# Altium schematic sheet Sheet1.SchDoc: VIOB
size 420 x 297 mm; ApprovedBy: PBaizan; CheckedBy: PBaizan; Author: PBaizan; CompanyName: IONOSENS; DrawnBy: PBaizan; Engineer: PBaizan; Organization: IONOSENS; DocumentNumber: 20210001002SCH; Revision: 01; SheetNumber: 01; SheetTotal: 03; PartNumber: 20210001001; SubTitle: VISIR Instrument Oscilloscope Board (Control); Scale: None; ConfigElement: VIOB; Project: VISIR; ENG_APP_DATE: 18/03/2021; DSN_APP_DATE: 18/03/2021; CHK_APP_DATE: 18/03/2021; CAGE_CODE: 0002-21; DOC_NO_SCH_DWG: 210001002SCH
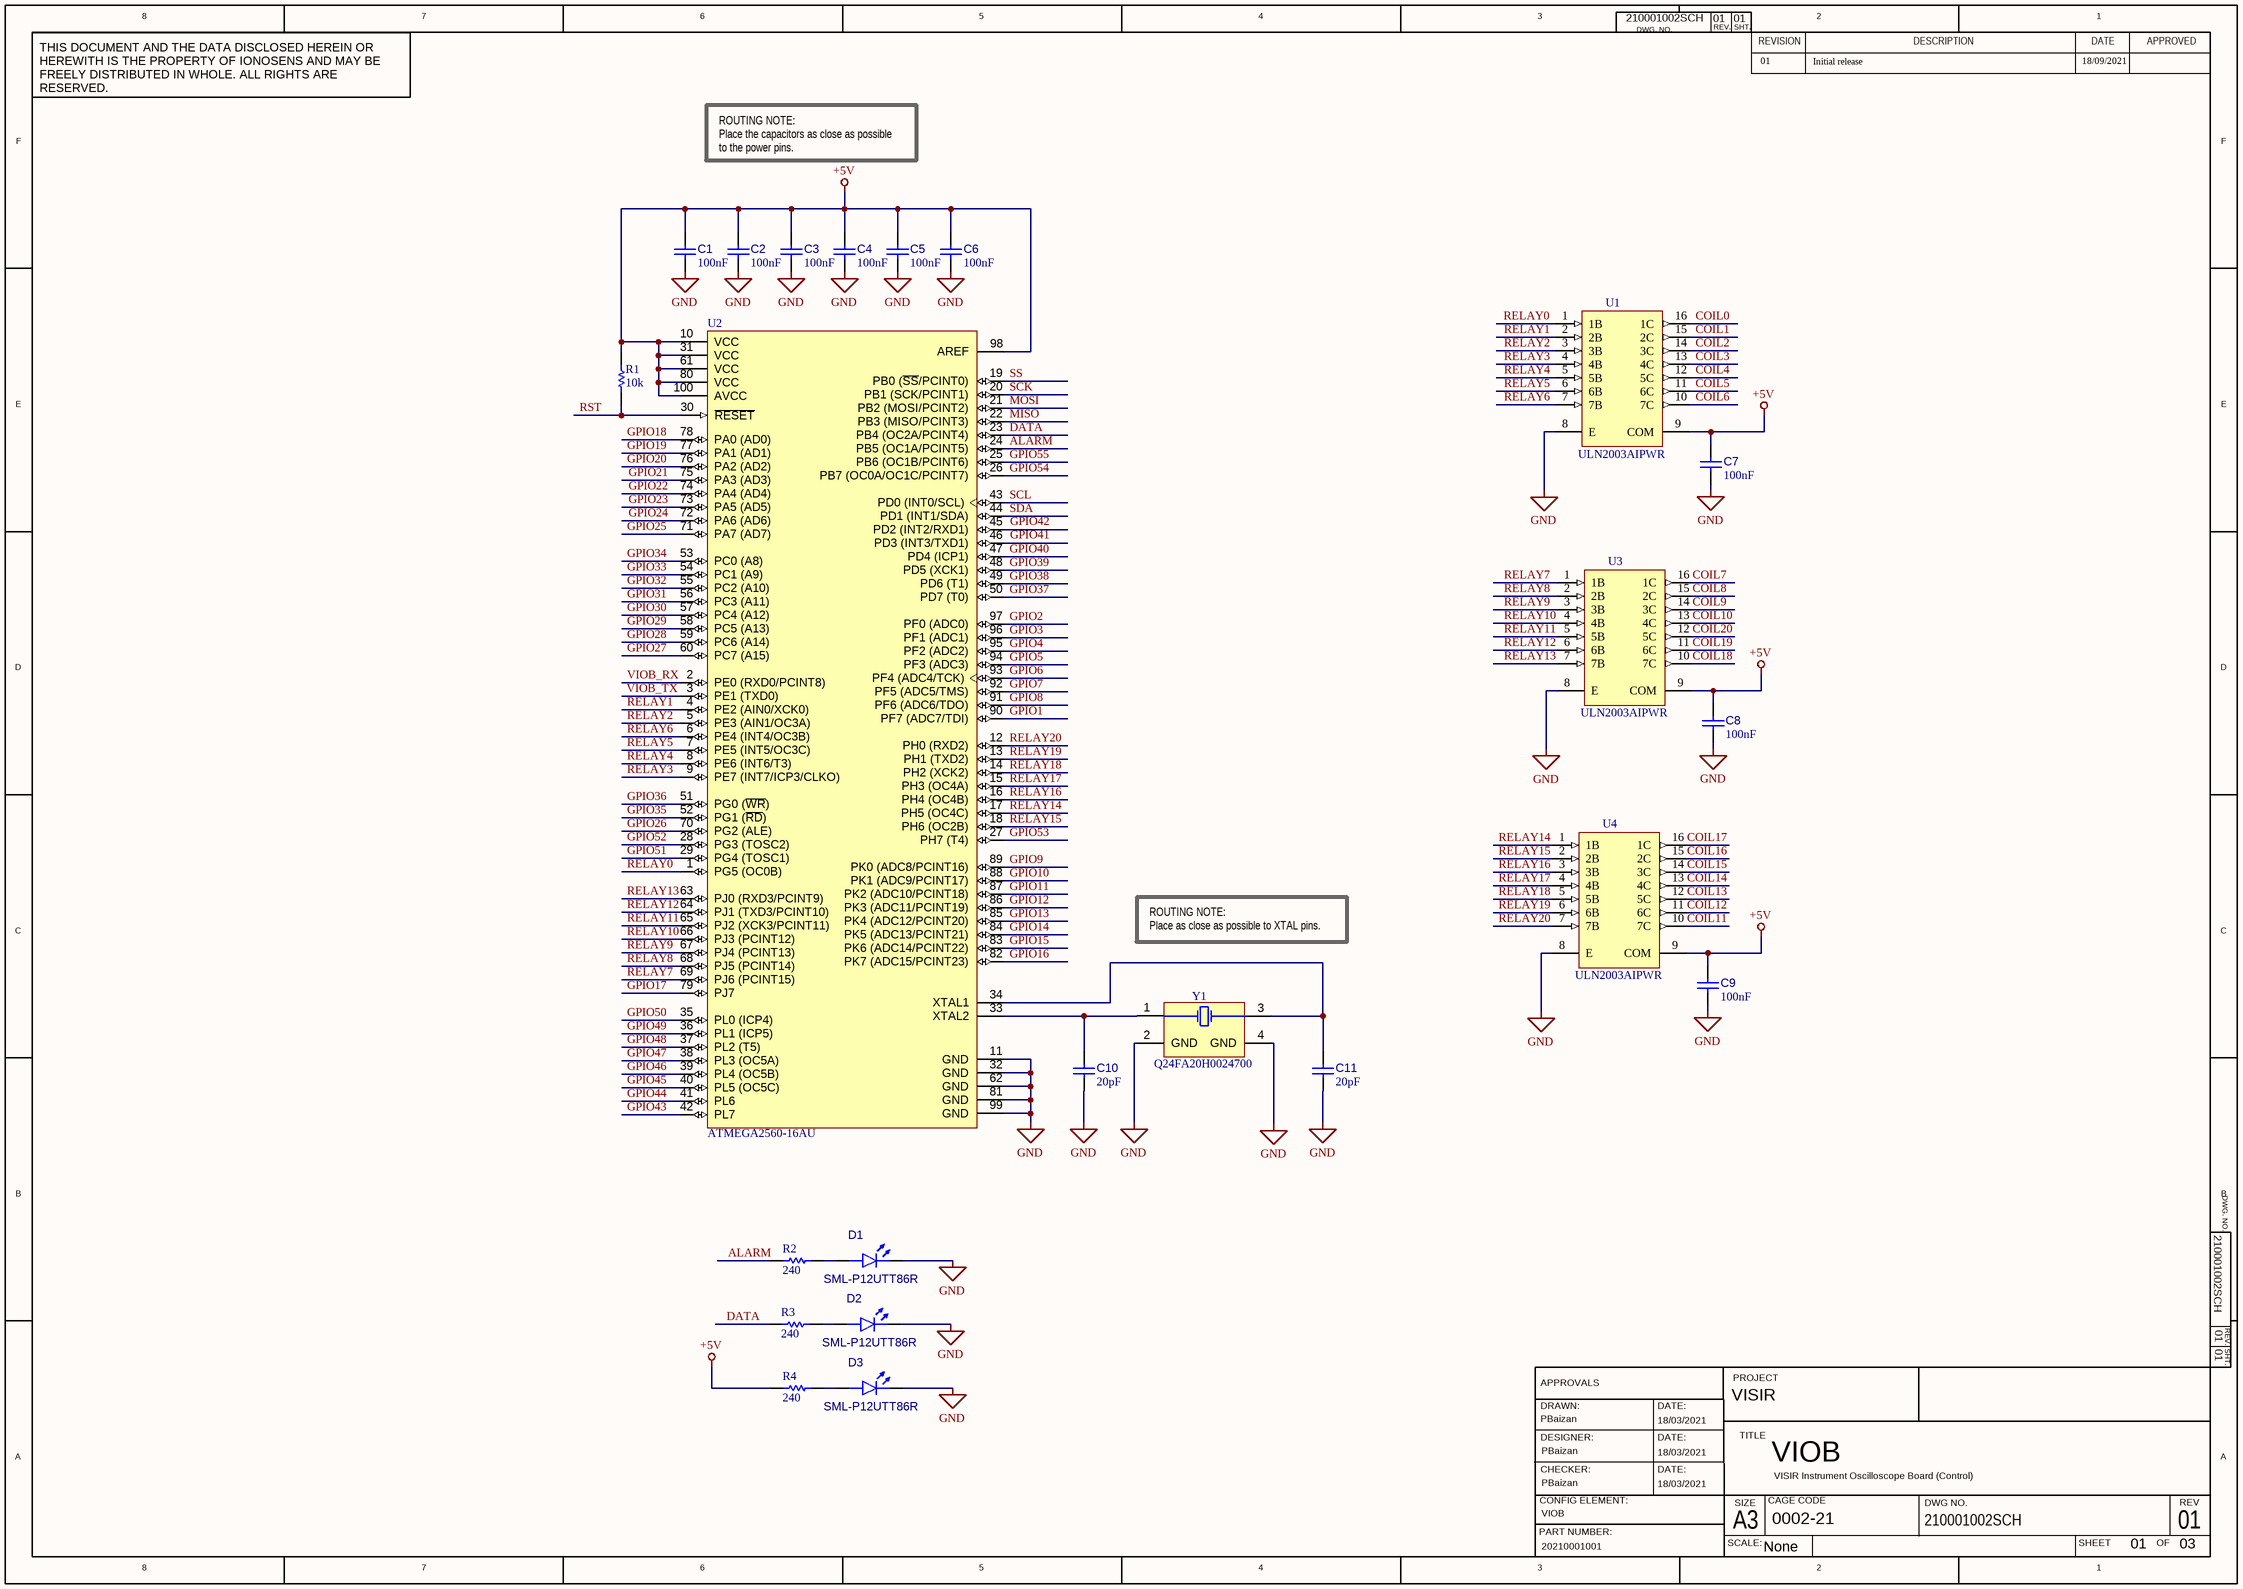
[diagram p0: Sheet1.SchDoc]

## Parts
C1  value 100nF  [CAPC1005X06M]  (hidden comment: CC0402JRX7R7BB104)
C2  value 100nF  [CAPC1005X06M]  (hidden comment: CC0402JRX7R7BB104)
C3  value 100nF  [CAPC1005X06M]  (hidden comment: CC0402JRX7R7BB104)
C4  value 100nF  [CAPC1005X06M]  (hidden comment: CC0402JRX7R7BB104)
C5  value 100nF  [CAPC1005X06M]  (hidden comment: CC0402JRX7R7BB104)
C6  value 100nF  [CAPC1005X06M]  (hidden comment: CC0402JRX7R7BB104)
C7  value 100nF  [CAPC1005X06M]  (hidden comment: CC0402JRX7R7BB104)
C8  value 100nF  [CAPC1005X06M]  (hidden comment: CC0402JRX7R7BB104)
C9  value 100nF  [CAPC1005X06M]  (hidden comment: CC0402JRX7R7BB104)
C10  value 20pF  [CAPC1005X06M]  (hidden comment: CC0402JRNPO9BN200)
C11  value 20pF  [CAPC1005X06M]  (hidden comment: CC0402JRNPO9BN200)
D1  SML-P12UTT86R  [DIOC1005X02R]
D2  SML-P12UTT86R  [DIOC1005X02R]
D3  SML-P12UTT86R  [DIOC1005X02R]
R1  value 10k  [RESC1005X04M]  (hidden comment: AC0402FR-0710KL)
R2  value 240  [RESC1005X04M]  (hidden comment: AC0402FR-07240RL)
R3  value 240  [RESC1005X04M]  (hidden comment: AC0402FR-07240RL)
R4  value 240  [RESC1005X04M]  (hidden comment: AC0402FR-07240RL)
U1  ULN2003AIPWR  [TSOP65P640X120-16M]
U2  ATMEGA2560-16AU  [ATML-100A_M]
U3  ULN2003AIPWR  [TSOP65P640X120-16M]
U4  ULN2003AIPWR  [TSOP65P640X120-16M]
Y1  Q24FA20H0024700  [FA-20H]

## Nets
+5V: C1.2 C2.2 C3.2 C4.2 C5.2 C6.2 C7.2 C8.2 C9.2 R1.2 R4.1 U1.9(COM) U2.10(VCC) U2.31(VCC) U2.61(VCC) U2.80(VCC) U2.98(AREF) U2.100(AVCC) U3.9(COM) U4.9(COM)
GND: C1.1 C2.1 C3.1 C4.1 C5.1 C6.1 C7.1 C8.1 C9.1 C10.1 C11.1 D1.1(K) D2.1(K) D3.1(K) U1.8(E) U2.11(GND) U2.32(GND) U2.62(GND) U2.81(GND) U2.99(GND) U3.8(E) U4.8(E) Y1.2(GND) Y1.4(GND)
ALARM: R2.1 U2.24(PB5_(OC1A/PCINT5))
COIL0: U1.16(1C)
COIL1: U1.15(2C)
COIL2: U1.14(3C)
COIL3: U1.13(4C)
COIL4: U1.12(5C)
COIL5: U1.11(6C)
COIL6: U1.10(7C)
COIL7: U3.16(1C)
COIL8: U3.15(2C)
COIL9: U3.14(3C)
COIL10: U3.13(4C)
COIL11: U4.10(7C)
COIL12: U4.11(6C)
COIL13: U4.12(5C)
COIL14: U4.13(4C)
COIL15: U4.14(3C)
COIL16: U4.15(2C)
COIL17: U4.16(1C)
COIL18: U3.10(7C)
COIL19: U3.11(6C)
COIL20: U3.12(5C)
DATA: R3.1 U2.23(PB4_(OC2A/PCINT4))
GPIO1: U2.90(PF7_(ADC7/TDI))
GPIO2: U2.97(PF0_(ADC0))
GPIO3: U2.96(PF1_(ADC1))
GPIO4: U2.95(PF2_(ADC2))
GPIO5: U2.94(PF3_(ADC3))
GPIO6: U2.93(PF4_(ADC4/TCK))
GPIO7: U2.92(PF5_(ADC5/TMS))
GPIO8: U2.91(PF6_(ADC6/TDO))
GPIO9: U2.89(PK0_(ADC8/PCINT16))
GPIO10: U2.88(PK1_(ADC9/PCINT17))
GPIO11: U2.87(PK2_(ADC10/PCINT18))
GPIO12: U2.86(PK3_(ADC11/PCINT19))
GPIO13: U2.85(PK4_(ADC12/PCINT20))
GPIO14: U2.84(PK5_(ADC13/PCINT21))
GPIO15: U2.83(PK6_(ADC14/PCINT22))
GPIO16: U2.82(PK7_(ADC15/PCINT23))
GPIO17: U2.79(PJ7)
GPIO18: U2.78(PA0_(AD0))
GPIO19: U2.77(PA1_(AD1))
GPIO20: U2.76(PA2_(AD2))
GPIO21: U2.75(PA3_(AD3))
GPIO22: U2.74(PA4_(AD4))
GPIO23: U2.73(PA5_(AD5))
GPIO24: U2.72(PA6_(AD6))
GPIO25: U2.71(PA7_(AD7))
GPIO26: U2.70(PG2_(ALE))
GPIO27: U2.60(PC7_(A15))
GPIO28: U2.59(PC6_(A14))
GPIO29: U2.58(PC5_(A13))
GPIO30: U2.57(PC4_(A12))
GPIO31: U2.56(PC3_(A11))
GPIO32: U2.55(PC2_(A10))
GPIO33: U2.54(PC1_(A9))
GPIO34: U2.53(PC0_(A8))
GPIO35: U2.52(PG1_(~{RD}))
GPIO36: U2.51(PG0_(~{WR}))
GPIO37: U2.50(PD7_(T0))
GPIO38: U2.49(PD6_(T1))
GPIO39: U2.48(PD5_(XCK1))
GPIO40: U2.47(PD4_(ICP1))
GPIO41: U2.46(PD3_(INT3/TXD1))
GPIO42: U2.45(PD2_(INT2/RXD1))
GPIO43: U2.42(PL7)
GPIO44: U2.41(PL6)
GPIO45: U2.40(PL5_(OC5C))
GPIO46: U2.39(PL4_(OC5B))
GPIO47: U2.38(PL3_(OC5A))
GPIO48: U2.37(PL2_(T5))
GPIO49: U2.36(PL1_(ICP5))
GPIO50: U2.35(PL0_(ICP4))
GPIO51: U2.29(PG4_(TOSC1))
GPIO52: U2.28(PG3_(TOSC2))
GPIO53: U2.27(PH7_(T4))
GPIO54: U2.26(PB7_(OC0A/OC1C/PCINT7))
GPIO55: U2.25(PB6_(OC1B/PCINT6))
MISO: U2.22(PB3_(MISO/PCINT3))
MOSI: U2.21(PB2_(MOSI/PCINT2))
RELAY0: U1.1(1B) U2.1(PG5_(OC0B))
RELAY1: U1.2(2B) U2.4(PE2_(AIN0/XCK0))
RELAY2: U1.3(3B) U2.5(PE3_(AIN1/OC3A))
RELAY3: U1.4(4B) U2.9(PE7_(INT7/ICP3/CLKO))
RELAY4: U1.5(5B) U2.8(PE6_(INT6/T3))
RELAY5: U1.6(6B) U2.7(PE5_(INT5/OC3C))
RELAY6: U1.7(7B) U2.6(PE4_(INT4/OC3B))
RELAY7: U2.69(PJ6_(PCINT15)) U3.1(1B)
RELAY8: U2.68(PJ5_(PCINT14)) U3.2(2B)
RELAY9: U2.67(PJ4_(PCINT13)) U3.3(3B)
RELAY10: U2.66(PJ3_(PCINT12)) U3.4(4B)
RELAY11: U2.65(PJ2_(XCK3/PCINT11)) U3.5(5B)
RELAY12: U2.64(PJ1_(TXD3/PCINT10)) U3.6(6B)
RELAY13: U2.63(PJ0_(RXD3/PCINT9)) U3.7(7B)
RELAY14: U2.17(PH5_(OC4C)) U4.1(1B)
RELAY15: U2.18(PH6_(OC2B)) U4.2(2B)
RELAY16: U2.16(PH4_(OC4B)) U4.3(3B)
RELAY17: U2.15(PH3_(OC4A)) U4.4(4B)
RELAY18: U2.14(PH2_(XCK2)) U4.5(5B)
RELAY19: U2.13(PH1_(TXD2)) U4.6(6B)
RELAY20: U2.12(PH0_(RXD2)) U4.7(7B)
RST: R1.1 U2.30(~{RESET})
SCK: U2.20(PB1_(SCK/PCINT1))
SCL: U2.43(PD0_(INT0/SCL))
SDA: U2.44(PD1_(INT1/SDA))
SS: U2.19(PB0_(~{SS}/PCINT0))
VIOB_RX: U2.2(PE0_(RXD0/PCINT8))
VIOB_TX: U2.3(PE1_(TXD0))
NetC10_2: C10.2 U2.33(XTAL2) Y1.1(X1)
NetC11_2: C11.2 U2.34(XTAL1) Y1.3(X2)
NetD1_2: D1.2(A) R2.2
NetD2_2: D2.2(A) R3.2
NetD3_2: D3.2(A) R4.2

## Notes on the sheet
- 01
- Initial release
- 18/09/2021
- ROUTING NOTE:
  Place the capacitors as close as possible to the power pins.
- ROUTING NOTE:
  Place as close as possible to XTAL pins.
- 8
- 7
- 6
- 5
- 4
- 3
- DWG. NO.
- REV.
- SHT.
- REVISION
- 2
- DESCRIPTION
- DATE
- 1
- APPROVED
- THIS DOCUMENT AND THE DATA DISCLOSED HEREIN OR HEREWITH IS THE PROPERTY OF IONOSENS AND MAY BE FREELY DISTRIBUTED IN WHOLE. ALL RIGHTS ARE RESERVED.
- F
- E
- D
- C
- B
- DRAWN:
- APPROVALS
- DATE:
- PROJECT
- A
- CHECKER:
- DESIGNER:
- TITLE
- PART NUMBER:
- CONFIG ELEMENT:
- SCALE:
- A3
- SIZE
- CAGE CODE
- DWG NO.
- SHEET
- OF
- REV

## Library data of the parts
C1-C9 = C01-0402-01-00001-1: Cap Ceramic 100nF 50V X7R 5% SMD 0402 125°C; Manufacturer: YAGEO; Voltage Rating: 16V; Case/Package: 0402; Capacitor Type: Ceramic; Min Operating Temperature: -55°C; Width: 508µm; Length: 1mm; Tolerance: 5%; Dielectric: X7R; RoHS Compliant: Yes; Pins: 2; Composition: Ceramic; Depth: 500µm; Voltage Rating (DC): 16V; Mount: Surface Mount; Mounting Technology: Surface Mount; Termination: SMD/SMT; Manufacturer P/N: CC0402JRX7R7BB104; Thickness: 558.8µm; Max Operating Temperature: 125°C
C10 C11 = C01-0402-01-00008-1: Cap Ceramic 20pF 50V C0G 5% SMD 0402 125°C; Manufacturer: YAGEO; Dielectric: COG; Case/Package: 0402; Tolerance: 5%; Thickness: 558.8µm; Termination: SMD/SMT; Manufacturer P/N: CC0402JRNPO9BN200; Voltage Rating: 50V; Length: 990.6µm; Depth: 500µm; Width: 508µm; Min Operating Temperature: -55°C; Mount: Surface Mount; Voltage Rating (DC): 50V; Pins: 2; Capacitor Type: Ceramic; RoHS Compliant: Yes; Composition: Ceramic; Mounting Technology: Surface Mount; Max Operating Temperature: 125°C
D1-D3 = D01-0402-01-00001-1: Led red 0402; Manufacturer: ROHM; Number of LEDs: 1; Max Power Dissipation: 52mW; Luminous Intensity: 85 mcd; Dominant Wavelength: 620 nm; Lens Style: Rectangular, Square; Forward Current: 20 mA; Forward Voltage: 2V; Mounting Technology: SMD; Case/Package: 0402; Min Operating Temperature: -40°C; Max Operating Temperature: 85°C; Manufacturer P/N: SML-P12UTT86R; Colour: red; RoHS Compliant: Yes; Pins: 2
R1 = R01-0402-01-00169-2: RES SMD 10K OHM 1% 1/16W 0402; Manufacturer: Yageo; Temperature Coefficient: 100 ppm/ºC; Power Rating: 62.5mW; Voltage Rating: 50V; Length: 990.6µm; Height: 370µm; Min Operating Temperature: -55°C; Case/Package: 0402; Features: Automotive AEC-Q200, Moisture Resistant; Packaging: Tape & Reel; Width: 508µm; Manufacturer P/N: AC0402FR-0710KL; RoHS: Yes; Max Operating Temperature: 155°C; Tolerance: 1%; Composition: Thick Film; Number of Terminations: 2
R2-R4 = R01-0402-01-00437-2: RES SMD 240 OHM 1% 1/16W 0402; Manufacturer: Yageo; Temperature Coefficient: 100 ppm/ºC; Power Rating: 62.5mW; Voltage Rating: 50V; Packaging: Tape & Reel; Manufacturer P/N: AC0402FR-07240RL; Height: 370µm; Case/Package: 0402; Composition: Thick Film; Max Operating Temperature: 155°C; Number of Terminations: 2; RoHS: Yes; Min Operating Temperature: -55°C; Tolerance: 1%; Width: 508µm; Length: 990.6µm; Features: Automotive AEC-Q200, Moisture Resistant
U1 U3 U4 = CMP-0005-0001-00001-1: 50-V, 7-ch darlington transistor array, -40 to 105C 16-TSSOP -40 to 105; Manufacturer: Texas Instruments; Voltage Rating: 50V; Min Operating Temperature: 105°C; RoHS Compliant: yes; Pins: 16; Case/Package: TSSOP; Mounting Technology: SMD; Length: 5mm; Manufacturer P/N: ULN2003AIPWR; Height: 1.2mm; Max Operating Temperature: -40°C; Width: 4.4mm
U2 = U01-0007-01-00000-1: AVR ATmega Microcontroller 8-bit 16MHz 256KB FLASH TQFP100; Manufacturer: Microchip; Oscillator Type: External; Interface: I2C, SPI, UART; Minimum Supply Voltage: 4.5V; Peripherals: Brown-out Detect/Reset, POR, PWM, WDT; Number of A/D: 1 AD / 16 channels; Watchdog Timer: Yes; Number of I/O: 86; RAM Size: 8KB; Max Supply Voltage: 5.5V; Max Operating Temperature: 85°C; Manufacturer P/N: ATMEGA2560-16AU; Memory Size: 256KB; Mounting Technology: SMD; Memory Type: FLASH; Pins: 100; Height: 1.2mm; Case/Package: A; RoHS: Yes; Min Operating Temperature: -40°C; Max Frequency: 16MHz; Number of Programmable I/O: 86; Contact Plating: Tin; Core Architecture: AVR; Frequency: 16MHz; Width: 16.25mm
Y1 = Y01-0001-01-00000-11: 16MHz ±10ppm 16pF 80Ω SMD-2520_4P; Manufacturer: SEIKO-EPSON; ESR: 80; RoHS Compliant: yes; Min Operating Temperature: -40°C; Load Capacitance: 16pF; Mounting Technology: SMD; Pins: 4; Case/Package: SMD-2520_4P; Max Operating Temperature: 85°C; Frequency: 16MHz; Manufacturer P/N: Q24FA20H0024700